# EAGLE schematic panelDoc (EAGLE 6.4)
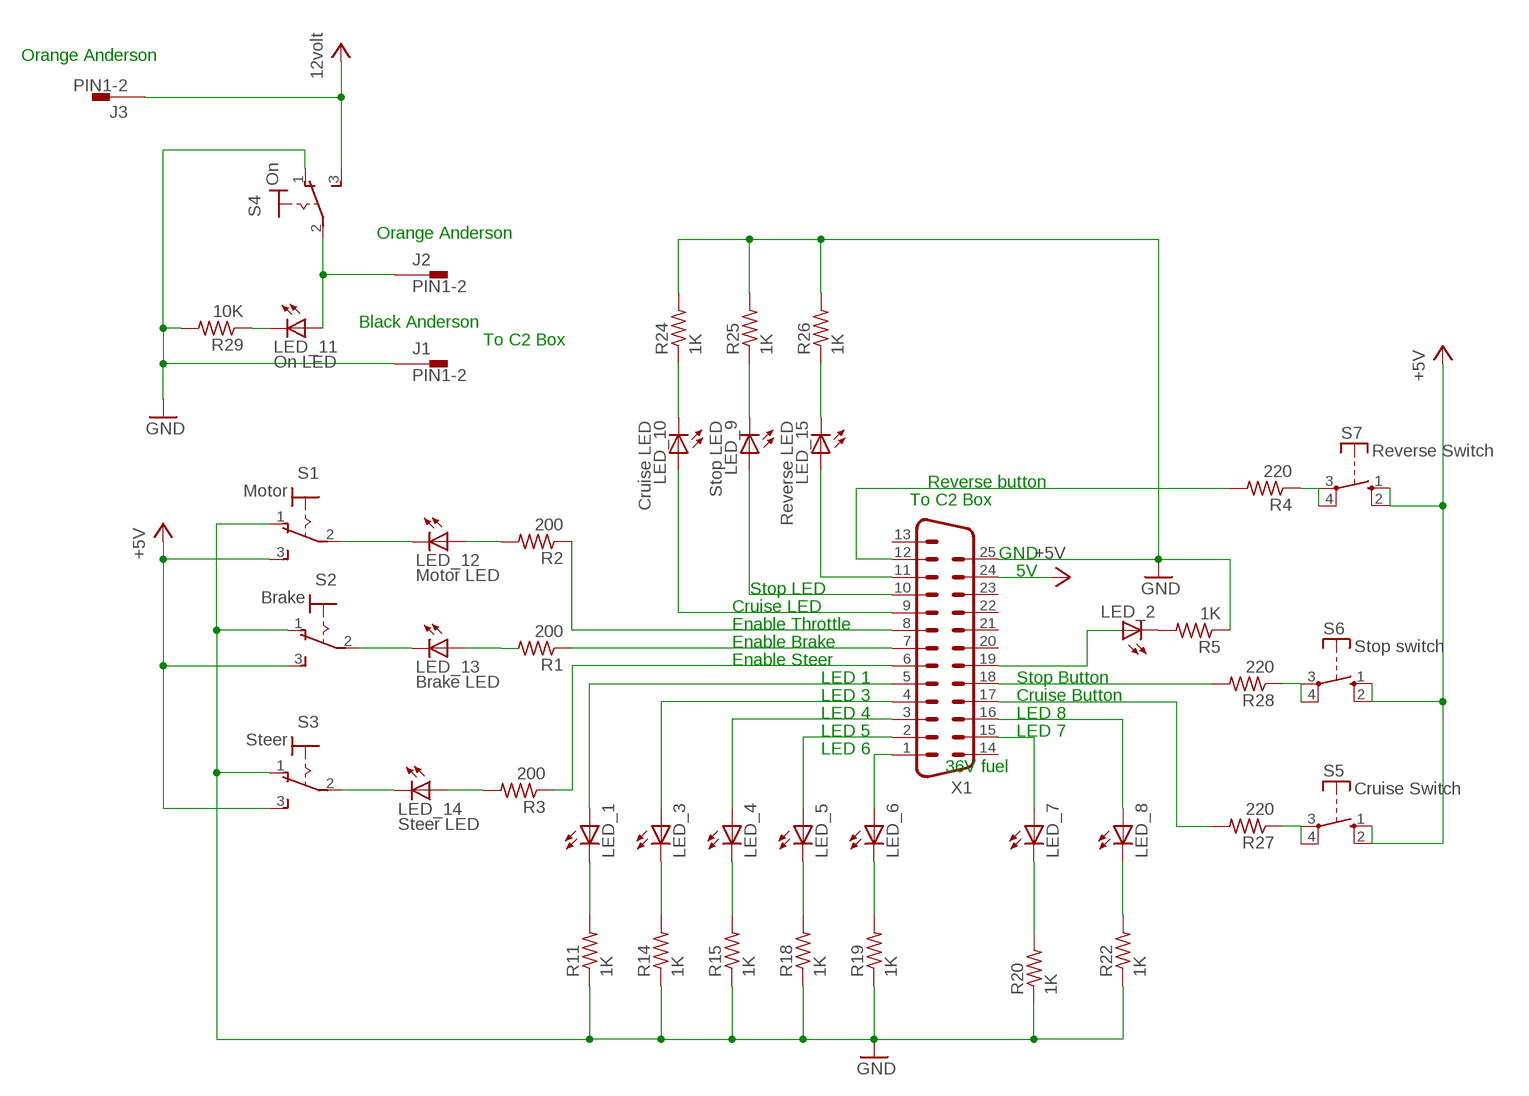
[diagram p0: schematic, sheet 1]

## Parts
J1  PIN1-2  [62221]
J2  PIN1-2  [62221]
J3  PIN1-2  [62221]
LED_1  LEDB156  [Q62902-B156]
LED_2  LEDB156  [Q62902-B156]
LED_3  LEDB156  [Q62902-B156]
LED_4  LEDB156  [Q62902-B156]
LED_5  LEDB156  [Q62902-B156]
LED_6  LEDB156  [Q62902-B156]
LED_7  LEDB156  [Q62902-B156]
LED_8  LEDB156  [Q62902-B156]
LED_9  Stop LED  LEDB156  [Q62902-B156]
LED_10  Cruise LED  LEDB156  [Q62902-B156]
LED_11  On LED  LEDB156  [Q62902-B156]
LED_12  Motor LED  LEDB156  [Q62902-B156]
LED_13  Brake LED  LEDB156  [Q62902-B156]
LED_14  Steer LED  LEDB156  [Q62902-B156]
LED_15  Reverse LED  LEDB156  [Q62902-B156]
R1  200  R-US_0204/7  [0204/7]
R2  200  R-US_0204/7  [0204/7]
R3  200  R-US_0204/7  [0204/7]
R4  220  R-US_0204/7  [0204/7]
R5  1K  R-US_0204/7  [0204/7]
R11  1K  R-US_0204/7  [0204/7]
R14  1K  R-US_0204/7  [0204/7]
R15  1K  R-US_0204/7  [0204/7]
R18  1K  R-US_0204/7  [0204/7]
R19  1K  R-US_0204/7  [0204/7]
R20  1K  R-US_0204/7  [0204/7]
R22  1K  R-US_0204/7  [0204/7]
R24  1K  R-US_0204/7  [0204/7]
R25  1K  R-US_0204/7  [0204/7]
R26  1K  R-US_0204/7  [0204/7]
R27  220  R-US_0204/7  [0204/7]
R28  220  R-US_0204/7  [0204/7]
R29  10K  R-US_0204/7  [0204/7]
S1  Motor  M9040P  [M9040P]
S2  Brake  M9040P  [M9040P]
S3  Steer  M9040P  [M9040P]
S4  On  M9040P  [M9040P]
S5  Cruise Switch  DTE6K  [DTE6K]
S6  Stop switch  DTE6K  [DTE6K]
S7  Reverse Switch  DTE6K  [DTE6K]
X1  M25-182  [182-025-MALE]

## Nets
+5V: J3.1 S1.3(S) S2.3(S) S3.3(S) S4.3(S) S5.1(S) S5.2(S) S6.1(S) S6.2(S) S7.1(S) S7.2(S) X1.24 ; supply symbol labelled 12volt
GND: J1.1 R5.1 R11.1 R14.1 R15.1 R18.1 R19.1 R20.1 R22.1 R24.2 R25.2 R26.2 R29.2 S1.1(O) S2.1(O) S3.1(O) S4.1(O) X1.25
N$1: R3.1 X1.6
N$2: LED_8.K(C) R22.2
N$3: LED_10.K(C) R24.1
N$4: LED_3.K(C) R14.2
N$5: LED_3.A X1.4
N$6: LED_4.K(C) R15.2
N$7: LED_4.A X1.3
N$8: LED_1.A X1.5
N$9: LED_8.A X1.16
N$10: LED_5.K(C) R18.2
N$11: LED_5.A X1.2
N$12: LED_6.K(C) R19.2
N$13: LED_6.A X1.1
N$14: LED_7.K(C) R20.2
N$15: LED_10.A X1.9
N$16: LED_1.K(C) R11.2
N$17: J2.1 LED_11.A S4.2(P)
N$18: LED_11.K(C) R29.1
N$19: R27.2 X1.17
N$20: LED_7.A X1.15
N$21: LED_12.A R2.2
N$22: LED_15.A X1.11
N$23: LED_12.K(C) S1.2(P)
N$24: LED_13.K(C) S2.2(P)
N$25: LED_9.K(C) R25.1
N$26: LED_9.A X1.10
N$27: LED_14.A R3.2
N$28: R2.1 X1.8
N$29: LED_13.A R1.2
N$30: LED_14.K(C) S3.2(P)
N$31: R4.2 X1.12
N$32: R1.1 X1.7
N$33: R4.1 S7.3(P) S7.4(P)
N$34: R27.1 S5.3(P) S5.4(P)
N$35: R28.2 X1.18
N$37: R28.1 S6.3(P) S6.4(P)
N$38: LED_2.K(C) R5.2
N$39: X1.19
REVERSE: LED_15.K(C) R26.1
Unconnected: LED_2.A X1.13 X1.14 X1.20 X1.21 X1.22 X1.23

## Notes on the sheet
- Orange Anderson
- Orange Anderson
- Black Anderson
- To C2 Box
- Reverse button
- To C2 Box
- GND
- 5V
- Stop LED
- Cruise LED
- Enable Throttle
- Enable Brake
- Enable Steer
- LED 1 | Stop Button
- LED 3 | Cruise Button
- LED 4 | LED 8
- LED 5 | LED 7
- LED 6
- 36V fuel

## Library data of the parts
J1-J3 = con-faston:PIN1-2: CONN TAB FASTON BRASS .187 PCB TAB, FSSTON, DUAL STAKE, .187 SERIES Digi-Key Part Number: A24734CT-ND Source: Tyco Electronics Corporation .. ENG_CD_62221_R.pdf http://search.digikey.com/scripts/DkSearch/dksus.dll?Detail&name=A24734CT-ND; MF: TYCO ELECTRONICS; MPN: 62221-1; OC_FARNELL: unknown; OC_NEWARK: 16H2318
LED_1-LED_15 = led:LED: LED OSRAM: - CHIPLED LG R971, LG N971, LY N971, LG Q971, LY Q971, LO R971, LY R971 LH N974, LH R974 LS Q976, LO Q976, LY Q976 LO Q996 - Hyper CHIPLED LW Q18S LB Q993, LB Q99A, LB R99A - SideLED LS A670, LO A670, LY A670, LG A670, LP A670 LB A673, LV A673, LT A673, LW A673 LH A674 LY A675 LS A676, LA A676, LO A676, LY A676, LW A676 LS A679, LY A679, LG A679 - Hyper Micro SIDELED® LS Y876, LA Y876, LO Y876, LY Y876 LT Y87S - SmartLED LW L88C, LW L88S LB L89C, LB L89S, LG L890 LS L89K, LO L89K, LY L89K LS L896, LA L896, LO L896, LY L896 - TOPLED LS T670, LO T670, LY T670, LG T670, LP T670 LSG T670, LSP T670, LSY T670, LOP T670, LYG T670 LG T671, LOG T671, LSG T671 LB T673, LV T673, LT T673, LW T673 LH T674 LS T676, LA T676, LO T676, LY T676, LB T676, LH T676, LSB T676, LW T676 LB T67C, LV T67C, LT T67C, LS T67K, LO T67K, LY T67K, LW E67C LS E67B, LA E67B, LO E67B, LY E67B, LB E67C, LV E67C, LT E67C LW T67C LS T679, LY T679, LG T679 LS T770, LO T770, LY T770, LG T770, LP T770 LB T773, LV T773, LT T773, LW T773 LH T774 LS E675, LA E675, LY E675, LS T675 LS T776, LA T776, LO T776, LY T776, LB T776 LHGB T686 LT T68C, LB T68C - Hyper Mini TOPLED® LB M676 - Mini TOPLED Santana® LG M470 LS M47K, LO M47K, LY M47K Source: http://www.osram.convergy.de LUXEON: - LUMILED® LXK2-PW12-R00, LXK2-PW12-S00, LXK2-PW14-U00, LXK2-PW14-V00 LXK2-PM12-R00, LXK2-PM12-S00, LXK2-PM14-U00 LXK2-PE12-Q00, LXK2-PE12-R00, LXK2-PE12-S00, LXK2-PE14-T00, LXK2-PE14-U00 LXK2-PB12-K00, LXK2-PB12-L00, LXK2-PB12-M00, LXK2-PB14-N00, LXK2-PB14-P00, LXK2-PB14-Q00 LXK2-PR12-L00, LXK2-PR12-M00, LXK2-PR14-Q00, LXK2-PR14-R00 LXK2-PD12-Q00, LXK2-PD12-R00, LXK2-PD12-S00 LXK2-PH12-R00, LXK2-PH12-S00 LXK2-PL12-P00, LXK2-PL12-Q00, LXK2-PL12-R00 Source: www.luxeon.com KINGBRIGHT: KA-3528ASYC Source: www.kingbright.com
R1-R5 R11 R14 R15 R18-R20 R22 R24-R29 = resistor:R-US_: RESISTOR, American symbol
S1-S4 = switch:M9040P: TOGGLE SWITCH Marquardt
S5-S7 = switch-misc:DT: ITT SWITCH
X1 = con-subd:M25: SUB-D; OC_FARNELL: unknown; OC_NEWARK: unknown